# Altium project PCB_Project.PrjPcb
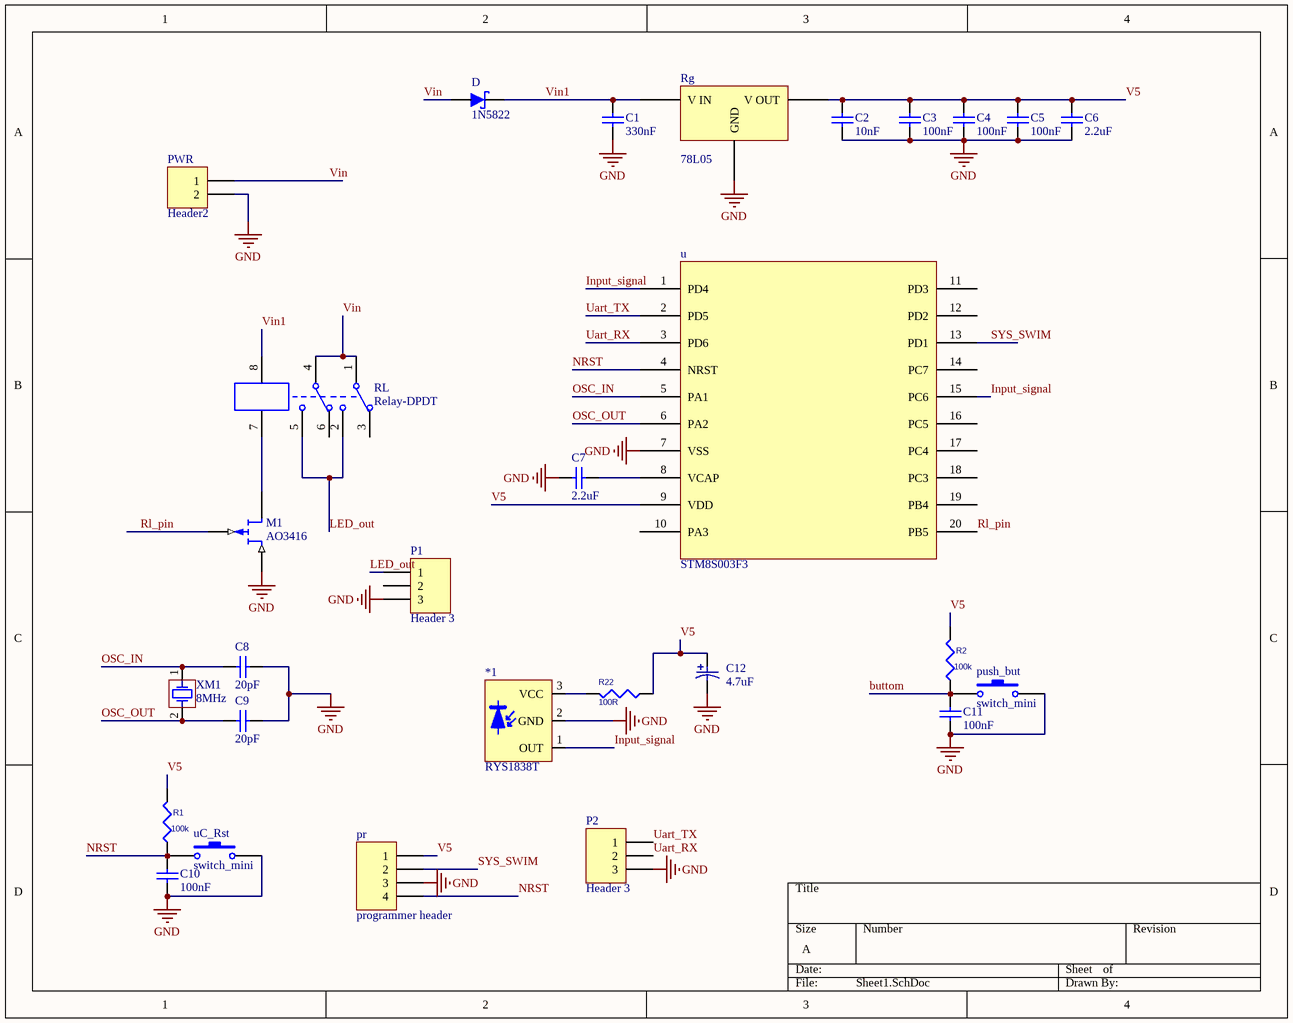
[diagram p0: Sheet1.SchDoc]
1 sheet, 28 parts. Net scope: global (net labels, ports and power ports of the same name join across sheets).
Board file: PCB1.PcbDoc

## Sheet Sheet1.SchDoc
size A

### Parts
*1  RYS1838T  [RYS1838T]
C1  330nF  [1206C]
C2  10nF  [1206C]
C3  100nF  [1206C]
C4  100nF  [1206C]
C5  100nF  [1206C]
C6  2.2uF  [0805C]
C7  2.2uF  [0805C]
C8  20pF  [1206C]
C9  20pF  [1206C]
C10  100nF  [1206C]
C11  100nF  [1206C]
C12  4.7uF  [SIZE_A]
D  1N5822  [430X270D]
M1  AO3416  [SOT23_3]
P1  Header 3  [HDR1X3]
P2  Header 3  [HDR1X3]
pr  programmer header  [HEADER_4_JMP]
push_but  switch_mini  [switch_mini_smd]
PWR  Header2  [COMM HEADER 2]
R1  100k  [0805L]
R2  100k  [0805L]
R22  100R  [0805L]
Rg  78L05  [SOT-89]
RL  Relay-DPDT  [RELAY-DPDT-1]
u  STM8S003F3  [TSSOP20_L]
uC_Rst  switch_mini  [switch_mini_smd]
XM1  8MHz  [XTLT_2]

### Nets
GND: *1.2(GND) C1.2 C2.2 C3.1 C4.1 C5.1 C6.1 C7.2 C8.2 C9.2 C10.1 C11.1 C12.2 M1.1(D) P1.3 P2.3 pr.3 push_but.2 PWR.2 Rg.2(GND) u.7(VSS) uC_Rst.2
buttom: C11.2 push_but.1 R2.1
Input_signal: *1.1(OUT) u.1(PD4) u.15(PC6)
LED_out: P1.1 RL.2 RL.5
NRST: C10.2 pr.4 R1.1 u.4(NRST) uC_Rst.1
OSC_IN: C8.1 u.5(PA1) XM1.1(OSC1)
OSC_OUT: C9.1 u.6(PA2) XM1.2(OSC2)
Rl_pin: M1.2(G) u.20(PB5)
SYS_SWIM: pr.2 u.13(PD1)
Uart_RX: P2.2 u.3(PD6)
Uart_TX: P2.1 u.2(PD5)
V5: C2.1 C3.2 C4.2 C5.2 C6.2 C12.1(+) pr.1 R1.2 R2.2 R22.1 Rg.1(V_OUT) u.9(VDD)
Vin: D.1 PWR.1 RL.1 RL.4
Vin1: C1.1 D.2 Rg.3(V_IN) RL.8
Net*1_3: *1.3(VCC) R22.2
NetC7_1: C7.1 u.8(VCAP)
NetM1_3: M1.3(S) RL.7

Not connected (* = marked no-connect by the designer): P1 2; RL 3 6; u 10(PA3) 11(PD3) 12(PD2) 14(PC7) 16(PC5) 17(PC4) 18(PC3) 19(PB4)

### Library data of the parts
C1-C11 = Cap: Capacitor
  C1: Value: 330nF
  C2: Value: 10nF
  C3-C5 C10 C11: Value: 100nF
  C6 C7: Value: 2.2uF
  C8 C9: Value: 20pF
C12 = Cap-Tantal: Capacitor, Tantalum,; Tolerance: 20%; Rated Voltage: 10 V; Capacitance: 47uF; Technology: Tantalum; Category: Capacitor
D = 1N5819
M1 = MESFET-P: P-Channel MESFET; pin to pad: 1>2 2>1; Published: 8-Jun-2000; LatestRevisionDate: 17-Jul-2002; LatestRevisionNote: Re-released for DXP Platform.; PackageReference: TO-18; Publisher: Altium Limited; PackageDescription: Can; 3 Leads; Pin Circle Dia. 2.54 mm; Lead Dia. 0.48 mm (max); Code_JEDEC: TO-18
P1 P2 = Header 3: Header, 3-Pin; LatestRevisionDate: 17-Jul-2002; LatestRevisionNote: Re-released for DXP Platform.; Publisher: Altium Limited
pr = Header 4: Header, 4-Pin; LatestRevisionDate: 17-Jul-2002; LatestRevisionNote: Re-released for DXP Platform.; Publisher: Altium Limited
PWR = Header 2: Header, 2-Pin; LatestRevisionDate: 17-Jul-2002; LatestRevisionNote: Re-released for DXP Platform.; Publisher: Altium Limited
R1 R2 R22 = R
  R1 R2: Value: *
  R22: Value: 100r
Rg = 78LXX: Voltage Regulator
RL = Relay-DPDT: Dual-Pole Dual-Throw Relay; Published: 24-Mar-1999; Revision: July-2002: Re-released for DXP Platform.; Publisher: Altium Limited
u = Component_1
XM1 = XTAL